# Altium schematic sheet Injectors.SchDoc: RB25DET - Injectors
size A4; Address1: Drawn By:; Address2: Dan Visser; DocumentNumber: A; Revision: 0.1; SheetNumber: 9; SheetTotal: 12
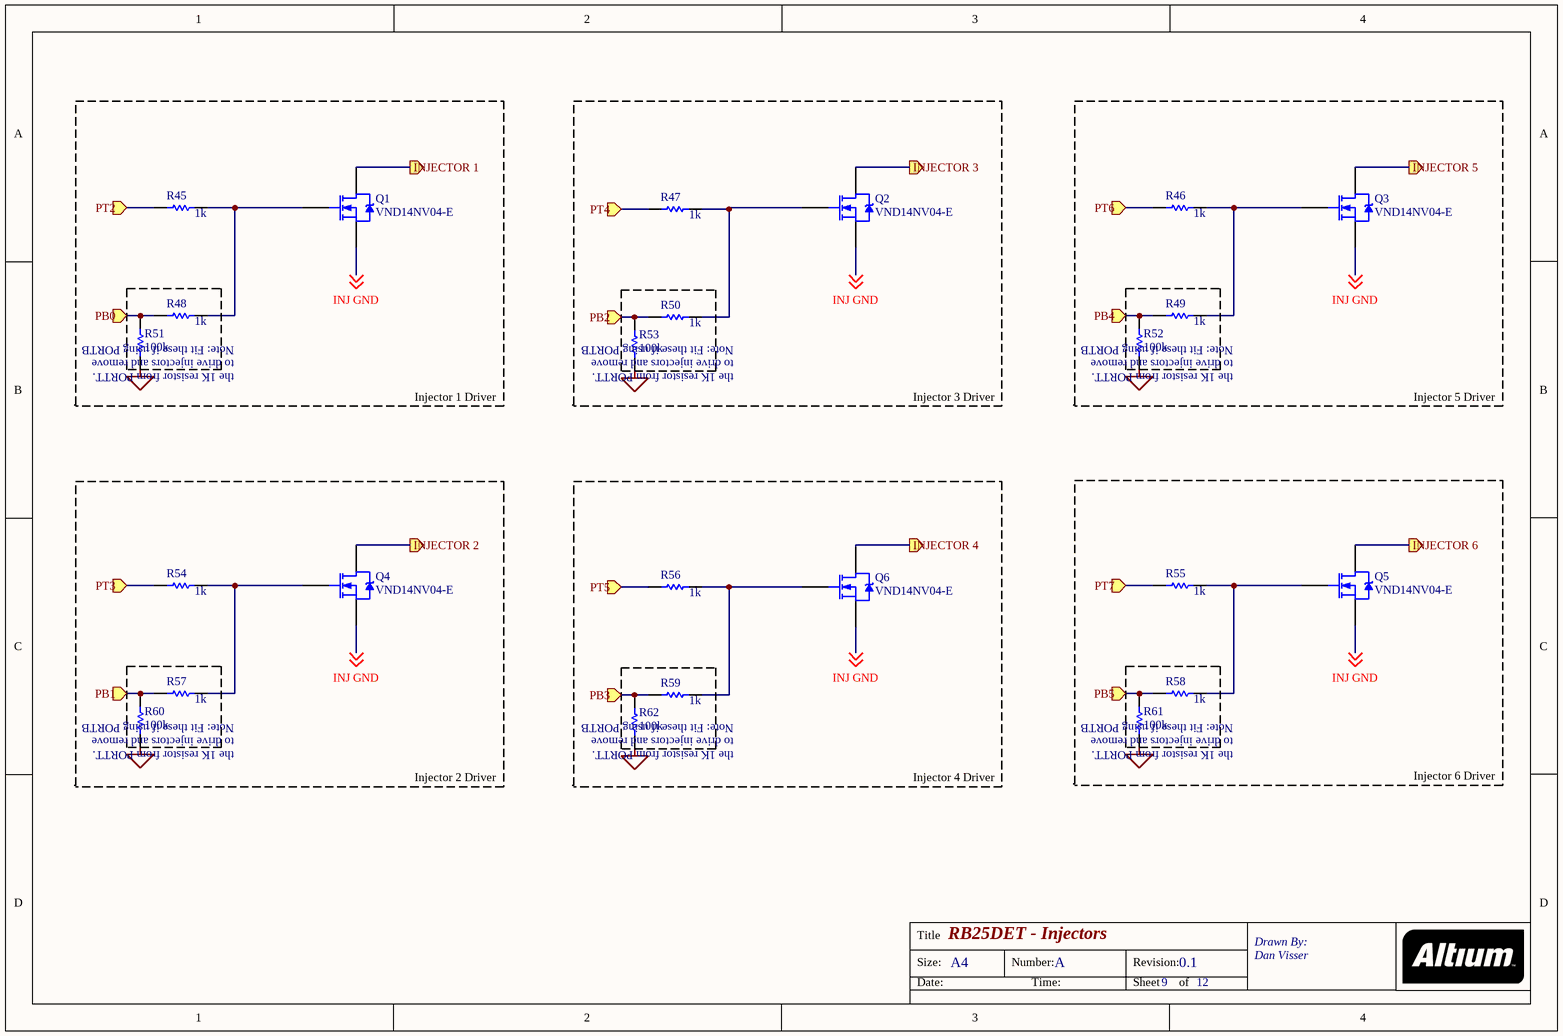
[diagram p0: Injectors.SchDoc]

## Parts
Q1  VND14NV04-E  [TO-220AB]
Q2  VND14NV04-E  [TO-220AB]
Q3  VND14NV04-E  [TO-220AB]
Q4  VND14NV04-E  [TO-220AB]
Q5  VND14NV04-E  [TO-220AB]
Q6  VND14NV04-E  [TO-220AB]
R45  value 1k  [AXIAL-0.3]
R46  value 1k  [AXIAL-0.3]
R47  value 1k  [AXIAL-0.3]
R48  value 1k  [AXIAL-0.3]
R49  value 1k  [AXIAL-0.3]
R50  value 1k  [AXIAL-0.3]
R51  value 100k  [AXIAL-0.3]
R52  value 100k  [AXIAL-0.3]
R53  value 100k  [AXIAL-0.3]
R54  value 1k  [AXIAL-0.3]
R55  value 1k  [AXIAL-0.3]
R56  value 1k  [AXIAL-0.3]
R57  value 1k  [AXIAL-0.3]
R58  value 1k  [AXIAL-0.3]
R59  value 1k  [AXIAL-0.3]
R60  value 100k  [AXIAL-0.3]
R61  value 100k  [AXIAL-0.3]
R62  value 100k  [AXIAL-0.3]

## Ports
INJECTOR 1 (out), INJECTOR 2 (out), INJECTOR 3 (out), INJECTOR 4 (out), INJECTOR 5 (out), INJECTOR 6 (out), PB0 (in), PB1 (in), PB2 (in), PB3 (in), PB4 (in), PB5 (in), PT2 (in), PT3 (in), PT4 (in), PT5 (in), PT6 (in), PT7 (in)

## Nets
NetR51_1: R51.1 R52.1 R53.1 R60.1 R61.1 R62.1
INJ GND: Q1.3(S) Q2.3(S) Q3.3(S) Q4.3(S) Q5.3(S) Q6.3(S) ; off-sheet INJ GND
INJECTOR 1: Q1.2(D) ; port INJECTOR 1
INJECTOR 2: Q4.2(D) ; port INJECTOR 2
INJECTOR 3: Q2.2(D) ; port INJECTOR 3
INJECTOR 4: Q6.2(D) ; port INJECTOR 4
INJECTOR 5: Q3.2(D) ; port INJECTOR 5
INJECTOR 6: Q5.2(D) ; port INJECTOR 6
PB0: R48.1 R51.2 ; port PB0
PB1: R57.1 R60.2 ; port PB1
PB2: R50.1 R53.2 ; port PB2
PB3: R59.1 R62.2 ; port PB3
PB4: R49.1 R52.2 ; port PB4
PB5: R58.1 R61.2 ; port PB5
PT2: R45.1 ; port PT2
PT3: R54.1 ; port PT3
PT4: R47.1 ; port PT4
PT5: R56.1 ; port PT5
PT6: R46.1 ; port PT6
PT7: R55.1 ; port PT7
NetQ1_1: Q1.1(G) R45.2 R48.2
NetQ2_1: Q2.1(G) R47.2 R50.2
NetQ3_1: Q3.1(G) R46.2 R49.2
NetQ4_1: Q4.1(G) R54.2 R57.2
NetQ5_1: Q5.1(G) R55.2 R58.2
NetQ6_1: Q6.1(G) R56.2 R59.2

## Notes on the sheet
- (near R48) Note: Fit these if using PORTB
- to drive injectors and remove
- the 1K resistor from PORTT.
- (near R50) Note: Fit these if using PORTB
- (near R49) Note: Fit these if using PORTB
- Injector 1 Driver
- Injector 3 Driver
- Injector 5 Driver
- (near R57) Note: Fit these if using PORTB
- (near R59) Note: Fit these if using PORTB
- (near R58) Note: Fit these if using PORTB
- Injector 2 Driver
- Injector 4 Driver
- Injector 6 Driver
- Title
- Size:
- Date:
- A4
- Number:
- Time:
- Revision:
- Sheet
- of

## Library data of the parts
Q1-Q6 = IRL520N: HEXFET Power MOSFET; Note: Pin 2 is electrically connected to pin 4 (Drain).; Published: 8-Jun-2000; LatestRevisionDate: 17-Jul-2002; LatestRevisionNote: Re-released for DXP Platform.; DatasheetVersion: May-1998; PackageVersion: Feb-1997; PackageReference: TO-220AB; Publisher: Altium Limited; PackageDescription: TO, Thru-Hole, Vertical, Heatsink Mounted; 3 In-Line Leads; Pitch 2.54 mm; ComponentLink1Description: Manufacturer Link; ComponentLink1URL: http://www.irf.com/; ComponentLink2Description: Datasheet; ComponentLink2URL: http://www.irf.com/product-info/datasheets/data/irl520n.pdf
R45-R62 = Res1: Resistor; Published: 8-Jun-2000; LatestRevisionDate: 17-Jul-2002; LatestRevisionNote: Re-released for DXP Platform.; PackageReference: AXIAL-0.3; Publisher: Altium Limited; PackageDescription: Axial Device, Thru-Hole; 2 Leads; 0.3 in Pin Spacing